# EAGLE schematic trigger (EAGLE 9.6.2)
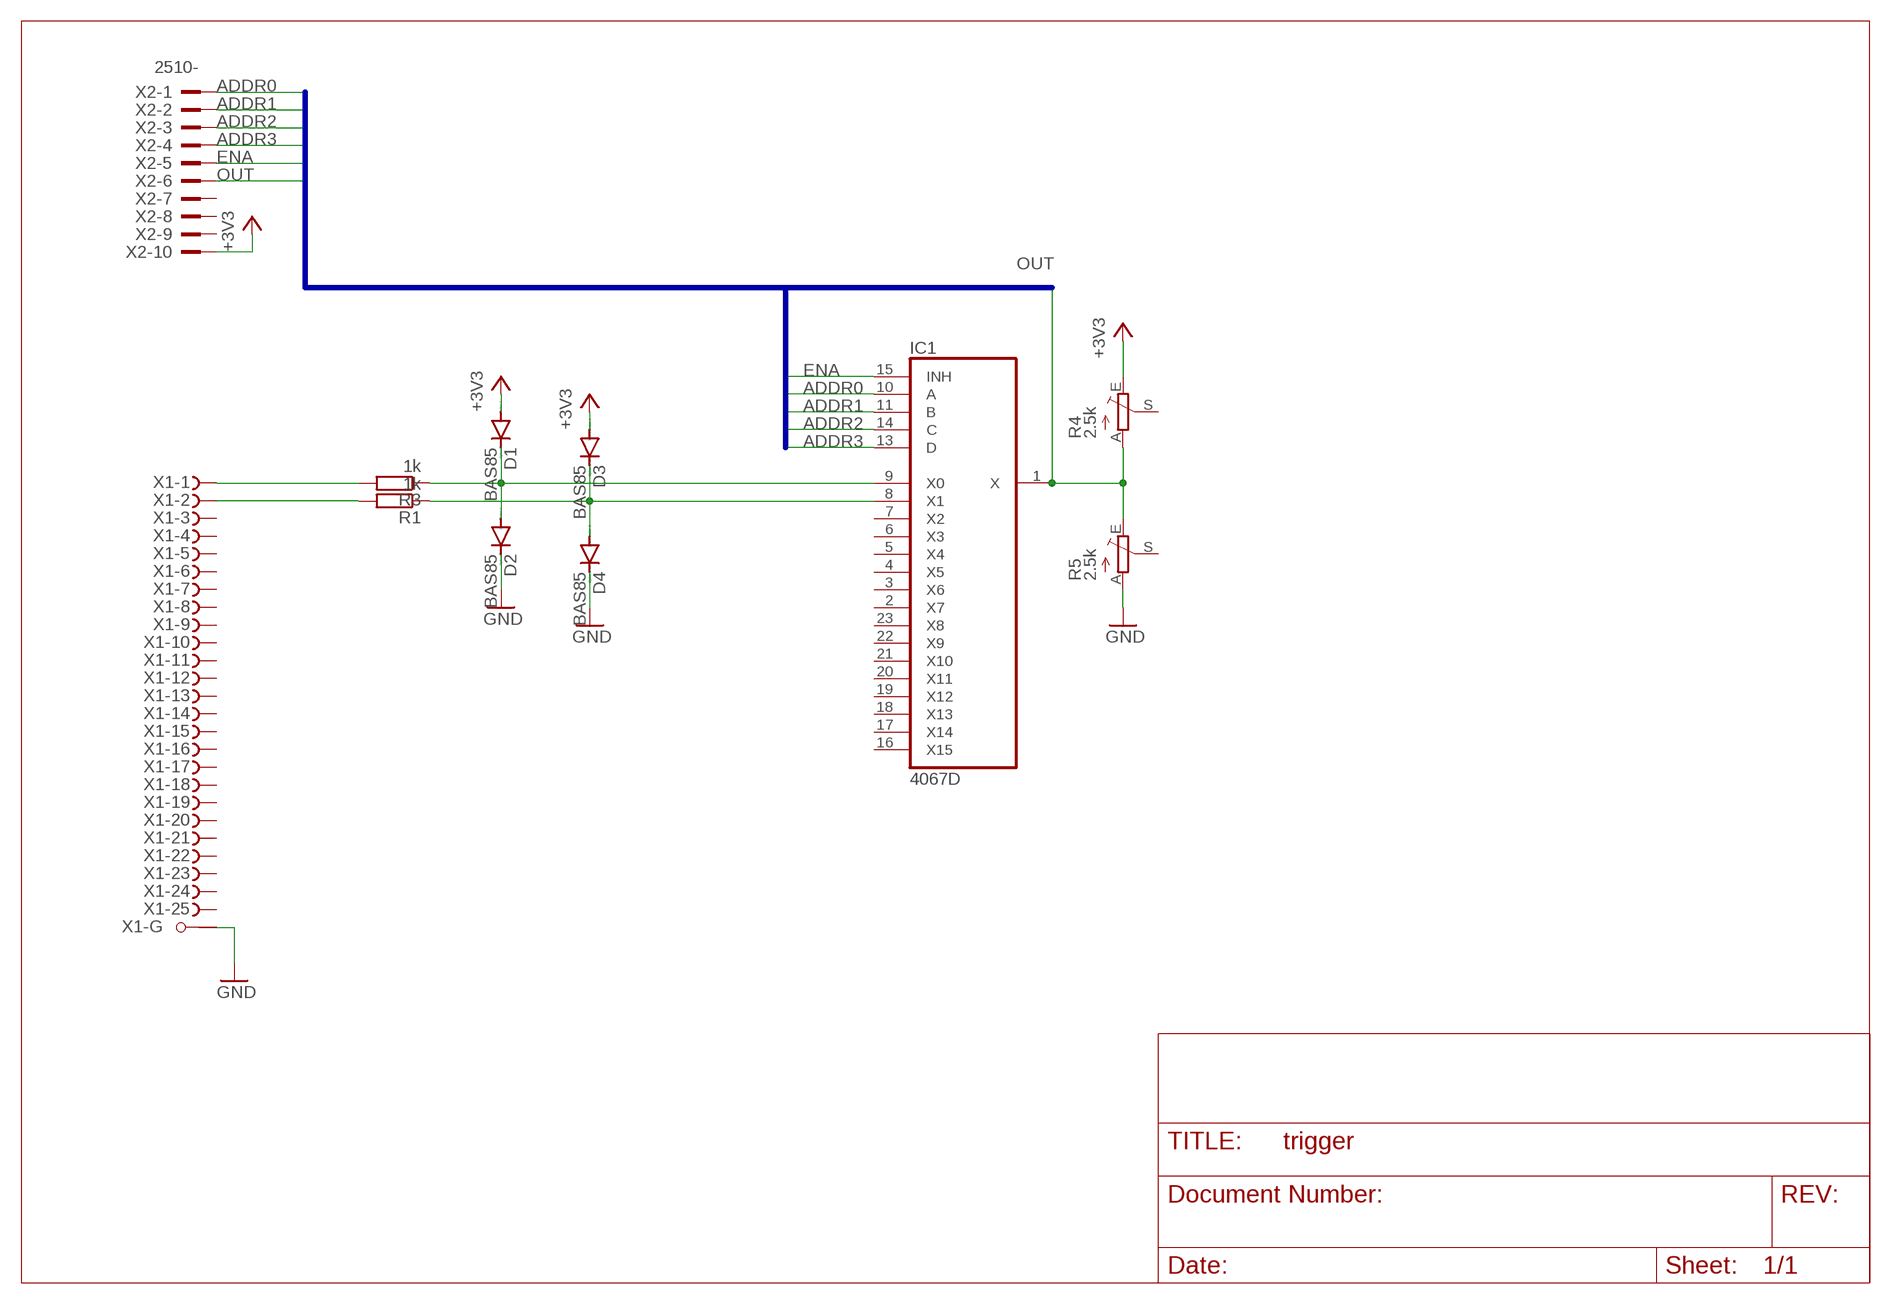
[diagram p0: schematic, sheet 1]

## Parts
D1  BAS85  DIODE-SOD80C  [SOD80C]
D2  BAS85  DIODE-SOD80C  [SOD80C]
D3  BAS85  DIODE-SOD80C  [SOD80C]
D4  BAS85  DIODE-SOD80C  [SOD80C]
IC1  4067D  [SO24W]
R1  1k  R-EU_0204/7  [0204/7]
R3  1k  R-EU_0204/7  [0204/7]
R4  2.5k  TRIM_EU-PT10  [PT-10]
R5  2.5k  TRIM_EU-PT10  [PT-10]
X1  F25HPS  [F25HP]
X2  2510-  [PAK100/2500-10]

## Nets
+3V3: D1.A D3.A R4.E X2.10
ADDR0: IC1.10(A) X2.1
ADDR1: IC1.11(B) X2.2
ADDR2: IC1.14(C) X2.3
ADDR3: IC1.13(D) X2.4
ENA: IC1.15(INH) X2.5
GND: D2.C D4.C R5.A X1.G1(-G:G1)
N$1: R3.2 X1.1(-1:F)
N$2: D1.C D2.A IC1.9(X0) R3.1
N$3: R1.2 X1.2(-2:F)
N$4: D3.C D4.A IC1.8(X1) R1.1
OUT: IC1.1(X) R4.A R5.E X2.6
Unconnected: IC1.2(X7) IC1.3(X6) IC1.4(X5) IC1.5(X4) IC1.6(X3) IC1.7(X2) IC1.16(X15) IC1.17(X14) IC1.18(X13) IC1.19(X12) IC1.20(X11) IC1.21(X10) IC1.22(X9) IC1.23(X8) R4.S R5.S X1.3(-3:F) X1.4(-4:F) X1.5(-5:F) X1.6(-6:F) X1.7(-7:F) X1.8(-8:F) X1.9(-9:F) X1.10(-10:F) X1.11(-11:F) X1.12(-12:F) X1.13(-13:F) X1.14(-14:F) X1.15(-15:F) X1.16(-16:F) X1.17(-17:F) X1.18(-18:F) X1.19(-19:F) X1.20(-20:F) X1.21(-21:F) X1.22(-22:F) X1.23(-23:F) X1.24(-24:F) X1.25(-25:F) X1.G2(-G:G2) X2.7 X2.8 X2.9

## Buses
ADDR[0..3],ENA,OUT

## Power pins joined to a net without a drawn wire
VDD: IC1.24(VDD)
VSS: IC1.12(VSS)

## Library data of the parts
D1-D4 = diode:DIODE-: DIODE
IC1 = 40xx:4067: 16-channel ANALOG MULTIPLEXER
R1 R3 = rcl:R-EU_: RESISTOR, European symbol; SPICEPREFIX: R
R4 R5 = pot:TRIM_EU-: POTENTIOMETER
X1 = con-subd:F25HPS: SUB-D; OC_FARNELL: unknown; OC_NEWARK: unknown
X2 = con-3m:2510-: 3M (TM) Pak 100 4-Wall Header Source: 3M; MF: 3M; MPN: 2510-6002UB; OC_FARNELL: 9838244; OC_NEWARK: 46F4725